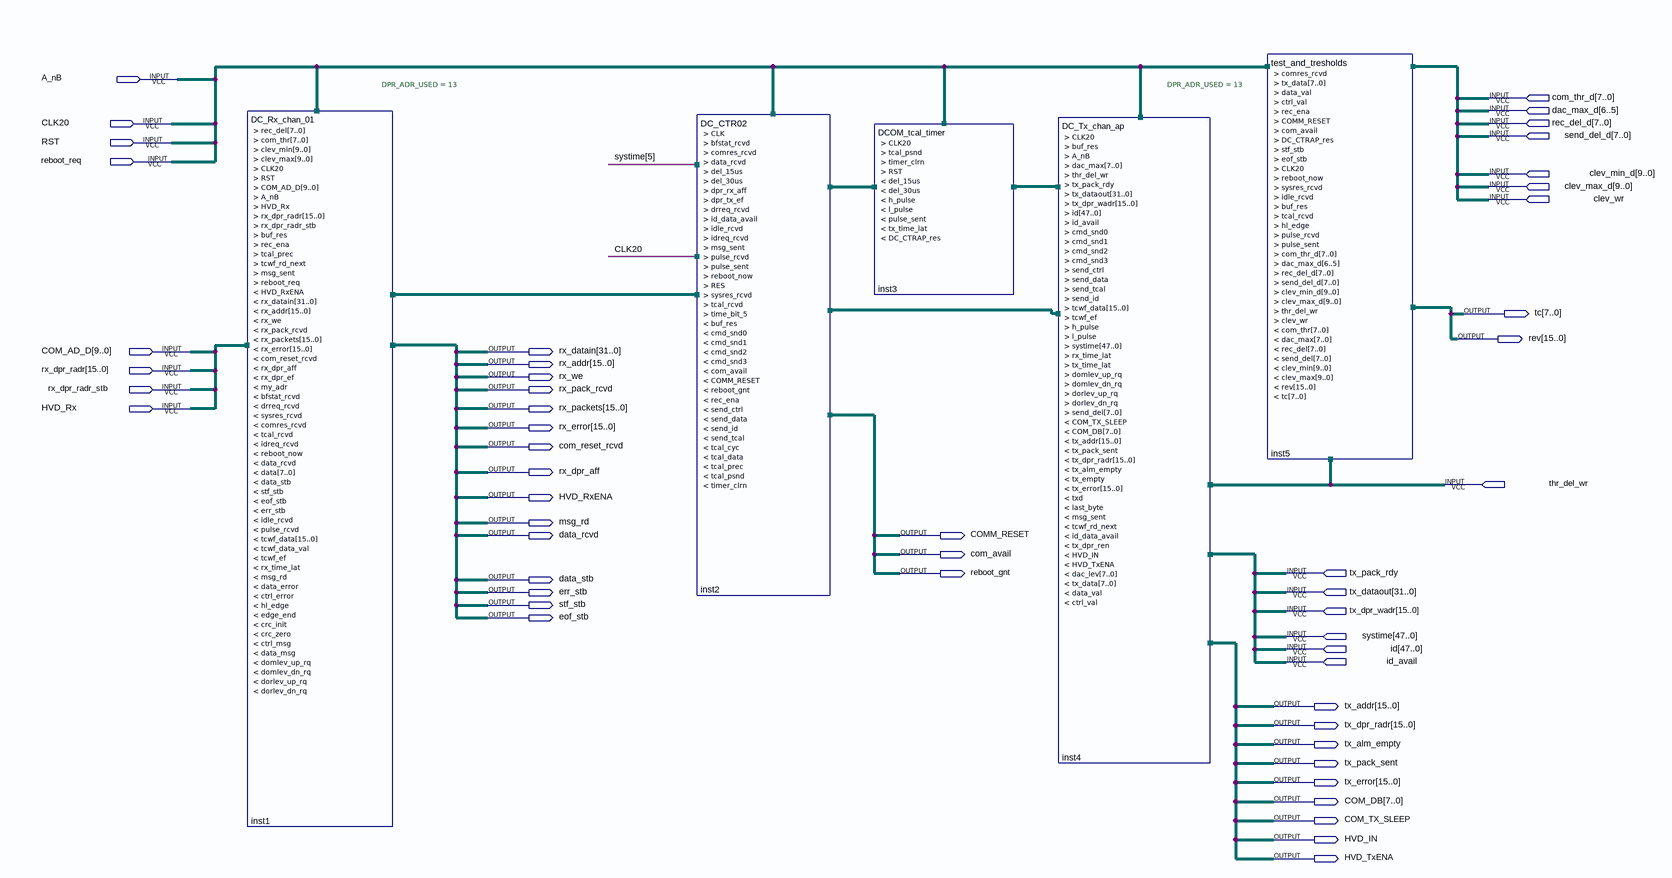
[diagram p0: schematic sheet]
// Quartus schematic dcom_ap.bdf as structural Verilog: 5 symbols, 51 pins
module dcom_ap (
  input  A_nB,
  input  [7:0] com_thr_d,
  input  [6:5] dac_max_d,
  input  CLK20,
  input  [7:0] rec_del_d,
  input  [7:0] send_del_d,
  input  RST,
  input  reboot_req,
  input  [9:0] clev_min_d,
  input  [9:0] clev_max_d,
  input  clev_wr,
  input  [9:0] COM_AD_D,
  input  [15:0] rx_dpr_radr,
  input  rx_dpr_radr_stb,
  input  HVD_Rx,
  input  thr_del_wr,
  input  tx_pack_rdy,
  input  [31:0] tx_dataout,
  input  [15:0] tx_dpr_wadr,
  input  [47:0] systime,
  input  [47:0] id,
  input  id_avail,
  output [7:0] tc,
  output [15:0] rev,
  output [31:0] rx_datain,
  output [15:0] rx_addr,
  output rx_we,
  output rx_pack_rcvd,
  output [15:0] rx_packets,
  output [15:0] rx_error,
  output com_reset_rcvd,
  output rx_dpr_aff,
  output HVD_RxENA,
  output msg_rd,
  output data_rcvd,
  output COMM_RESET,
  output com_avail,
  output reboot_gnt,
  output data_stb,
  output err_stb,
  output stf_stb,
  output eof_stb,
  output [15:0] tx_addr,
  output [15:0] tx_dpr_radr,
  output tx_alm_empty,
  output tx_pack_sent,
  output [15:0] tx_error,
  output [7:0] COM_DB,
  output COM_TX_SLEEP,
  output HVD_IN,
  output HVD_TxENA
);

  wire bfstat_rcvd, buf_res, cmd_snd0, cmd_snd1, cmd_snd2, cmd_snd3, comres_rcvd, ctrl_val, data_val,
       DC_CTRAP_res, del_15us, del_30us, domlev_dn_rq, domlev_up_rq, dorlev_dn_rq, dorlev_up_rq, drreq_rcvd,
       h_pulse, hl_edge, id_data_avail, idle_rcvd, idreq_rcvd, l_pulse, msg_sent, pulse_rcvd, pulse_sent,
       reboot_now, rec_ena, rx_time_lat, send_ctrl, send_data, send_id, send_tcal, sysres_rcvd, tcal_prec,
       tcal_psnd, tcal_rcvd, tcwf_ef, tcwf_rd_next, timer_clrn, tx_empty, tx_time_lat;
  wire [7:0] com_thr, dac_max, rec_del, send_del, tx_data;
  wire [9:0] clev_max, clev_min;
  wire [15:0] tcwf_data;

  DC_Rx_chan_01 #(.DPR_ADR_USED(13)) inst1 (
    .rec_del(rec_del), .com_thr(com_thr), .clev_min(clev_min), .clev_max(clev_max), .CLK20(CLK20), .RST(RST),
    .COM_AD_D(COM_AD_D), .A_nB(A_nB), .HVD_Rx(HVD_Rx), .rx_dpr_radr(rx_dpr_radr),
    .rx_dpr_radr_stb(rx_dpr_radr_stb), .buf_res(buf_res), .rec_ena(rec_ena), .tcal_prec(tcal_prec),
    .tcwf_rd_next(tcwf_rd_next), .msg_sent(msg_sent), .reboot_req(reboot_req), .HVD_RxENA(HVD_RxENA),
    .rx_datain(rx_datain), .rx_addr(rx_addr), .rx_we(rx_we), .rx_pack_rcvd(rx_pack_rcvd),
    .rx_packets(rx_packets), .rx_error(rx_error), .com_reset_rcvd(com_reset_rcvd), .rx_dpr_aff(rx_dpr_aff),
    .bfstat_rcvd(bfstat_rcvd), .drreq_rcvd(drreq_rcvd), .sysres_rcvd(sysres_rcvd), .comres_rcvd(comres_rcvd),
    .tcal_rcvd(tcal_rcvd), .idreq_rcvd(idreq_rcvd), .reboot_now(reboot_now), .data_rcvd(data_rcvd),
    .data_stb(data_stb), .stf_stb(stf_stb), .eof_stb(eof_stb), .err_stb(err_stb), .idle_rcvd(idle_rcvd),
    .pulse_rcvd(pulse_rcvd), .tcwf_data(tcwf_data), .tcwf_ef(tcwf_ef), .rx_time_lat(rx_time_lat),
    .msg_rd(msg_rd), .hl_edge(hl_edge), .domlev_up_rq(domlev_up_rq), .domlev_dn_rq(domlev_dn_rq),
    .dorlev_up_rq(dorlev_up_rq), .dorlev_dn_rq(dorlev_dn_rq));  // open: rx_dpr_ef, my_adr, data, tcwf_data_val, data_error, ctrl_error, edge_end, crc_init, crc_zero, ctrl_msg, data_msg
  DC_CTR02 inst2 (
    .CLK(CLK20), .bfstat_rcvd(bfstat_rcvd), .comres_rcvd(comres_rcvd), .data_rcvd(data_rcvd),
    .del_15us(del_15us), .del_30us(del_30us), .dpr_rx_aff(rx_dpr_aff), .dpr_tx_ef(tx_empty),
    .drreq_rcvd(drreq_rcvd), .id_data_avail(id_data_avail), .idle_rcvd(idle_rcvd), .idreq_rcvd(idreq_rcvd),
    .msg_sent(msg_sent), .pulse_rcvd(pulse_rcvd), .pulse_sent(pulse_sent), .reboot_now(reboot_now),
    .RES(DC_CTRAP_res), .sysres_rcvd(sysres_rcvd), .tcal_rcvd(tcal_rcvd), .time_bit_5(systime[5]),
    .buf_res(buf_res), .cmd_snd0(cmd_snd0), .cmd_snd1(cmd_snd1), .cmd_snd2(cmd_snd2), .cmd_snd3(cmd_snd3),
    .com_avail(com_avail), .COMM_RESET(COMM_RESET), .reboot_gnt(reboot_gnt), .rec_ena(rec_ena),
    .send_ctrl(send_ctrl), .send_data(send_data), .send_id(send_id), .send_tcal(send_tcal),
    .tcal_prec(tcal_prec), .tcal_psnd(tcal_psnd), .timer_clrn(timer_clrn));  // open: tcal_cyc, tcal_data
  DCOM_tcal_timer inst3 (
    .CLK20(CLK20), .tcal_psnd(tcal_psnd), .timer_clrn(timer_clrn), .RST(RST), .del_15us(del_15us),
    .del_30us(del_30us), .h_pulse(h_pulse), .l_pulse(l_pulse), .pulse_sent(pulse_sent),
    .tx_time_lat(tx_time_lat), .DC_CTRAP_res(DC_CTRAP_res));
  DC_Tx_chan_ap #(.DPR_ADR_USED(13)) inst4 (
    .CLK20(CLK20), .buf_res(buf_res), .A_nB(A_nB), .dac_max(dac_max), .thr_del_wr(thr_del_wr),
    .tx_pack_rdy(tx_pack_rdy), .tx_dataout(tx_dataout), .tx_dpr_wadr(tx_dpr_wadr), .id(id),
    .id_avail(id_avail), .cmd_snd0(cmd_snd0), .cmd_snd1(cmd_snd1), .cmd_snd2(cmd_snd2), .cmd_snd3(cmd_snd3),
    .send_ctrl(send_ctrl), .send_data(send_data), .send_tcal(send_tcal), .send_id(send_id),
    .tcwf_data(tcwf_data), .tcwf_ef(tcwf_ef), .h_pulse(h_pulse), .l_pulse(l_pulse), .systime(systime),
    .rx_time_lat(rx_time_lat), .tx_time_lat(tx_time_lat), .domlev_up_rq(domlev_up_rq),
    .domlev_dn_rq(domlev_dn_rq), .dorlev_up_rq(dorlev_up_rq), .dorlev_dn_rq(dorlev_dn_rq),
    .send_del(send_del), .COM_TX_SLEEP(COM_TX_SLEEP), .COM_DB(COM_DB), .tx_addr(tx_addr),
    .tx_pack_sent(tx_pack_sent), .tx_dpr_radr(tx_dpr_radr), .tx_alm_empty(tx_alm_empty), .tx_error(tx_error),
    .msg_sent(msg_sent), .tcwf_rd_next(tcwf_rd_next), .id_data_avail(id_data_avail), .HVD_IN(HVD_IN),
    .HVD_TxENA(HVD_TxENA), .tx_data(tx_data), .data_val(data_val), .ctrl_val(ctrl_val));  // open: tx_empty, txd, last_byte, tx_dpr_ren, dac_lev
  test_and_tresholds inst5 (
    .comres_rcvd(comres_rcvd), .tx_data(tx_data), .data_val(data_val), .ctrl_val(ctrl_val),
    .rec_ena(rec_ena), .COMM_RESET(COMM_RESET), .com_avail(com_avail), .DC_CTRAP_res(DC_CTRAP_res),
    .stf_stb(stf_stb), .eof_stb(eof_stb), .CLK20(CLK20), .reboot_now(reboot_now), .sysres_rcvd(sysres_rcvd),
    .idle_rcvd(idle_rcvd), .buf_res(buf_res), .tcal_rcvd(tcal_rcvd), .hl_edge(hl_edge),
    .pulse_rcvd(pulse_rcvd), .pulse_sent(pulse_sent), .com_thr_d(com_thr_d), .dac_max_d(dac_max_d),
    .rec_del_d(rec_del_d), .send_del_d(send_del_d), .clev_min_d(clev_min_d), .clev_max_d(clev_max_d),
    .thr_del_wr(thr_del_wr), .clev_wr(clev_wr), .com_thr(com_thr), .dac_max(dac_max), .rec_del(rec_del),
    .send_del(send_del), .clev_min(clev_min), .clev_max(clev_max), .rev(rev), .tc(tc));
endmodule
